# Altium schematic sheet SkyPulseUAV_MCU.SchDoc: SkyPulseUAV_MCU
size A4; Date: March 2, 2024; Author: Binhan Tian; Revision: V0.1; SheetNumber: 4; SheetTotal: 5
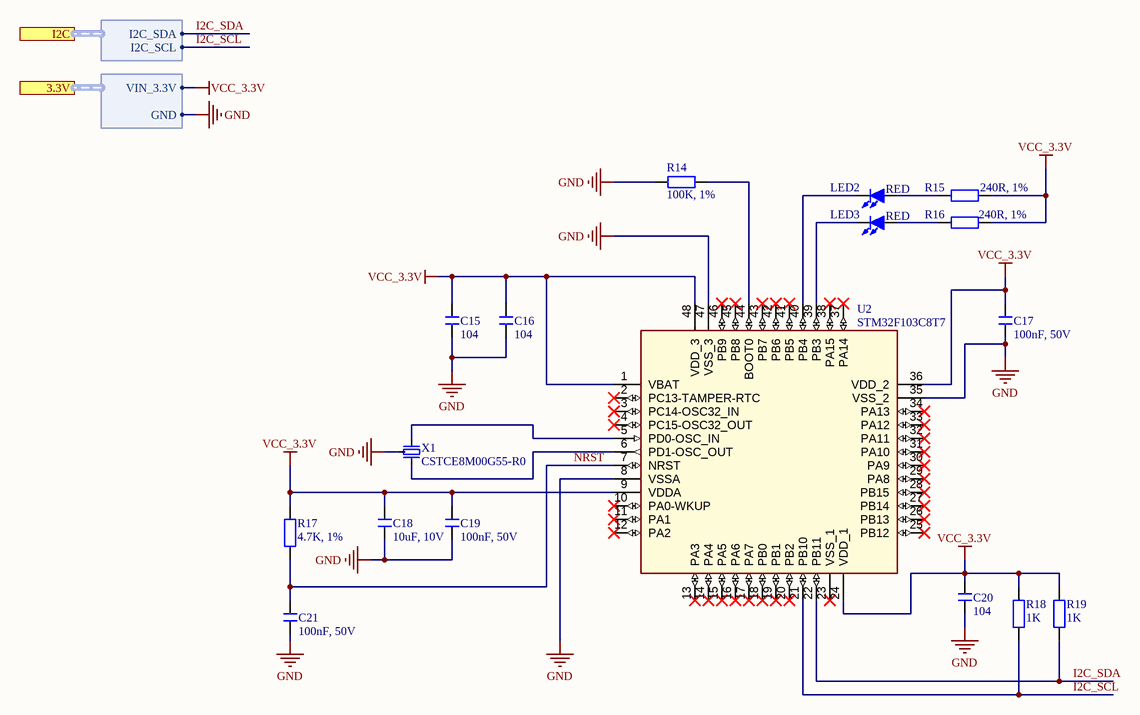
[diagram p0: SkyPulseUAV_MCU.SchDoc]

## Parts
C15  104  [C 0805_M]
C16  104  [C 0805_M]
C17  100nF, 50V  [C 0805_M]
C18  10uF, 10V  [C 0805_M]
C19  100nF, 50V  [C 0805_M]
C20  104  [C 0805_M]
C21  100nF, 50V  [C 0805_M]
LED2  RED  [LED 0805B]
LED3  RED  [LED 0805B]
R14  100K, 1%  [R 0805_M]
R15  240R, 1%  [R 0805_M]
R16  240R, 1%  [R 0805_M]
R17  4.7K, 1%  [R 0805_M]
R18  1K  [R 0805_M]
R19  1K  [R 0805_M]
U2  STM32F103C8T7  [TSQFP50P900X900X160-48L]
X1  CSTCE8M00G55-R0  [CSTCE_G]

## Ports
3.3V (harness Power), I2C (harness I2C BUS)

## Harnesses
I2C BUS: I2C_SDA, I2C_SCL
Power: VIN_3.3V, GND

## Nets
GND: C15.1 C16.1 C17.1 C18.1 C19.1 C20.2 C21.1 R14.1 U2.8(VSSA) U2.35(VSS_2) U2.47(VSS_3) X1.2(GND) ; port 3.3V.GND
VCC_3.3V: C15.2 C16.2 C17.2 C18.2 C19.2 C20.1 R15.2 R16.2 R17.2 R18.2 R19.2 U2.1(VBAT) U2.9(VDDA) U2.24(VDD_1) U2.36(VDD_2) U2.48(VDD_3) ; port 3.3V.VIN_3.3V
I2C_SCL: R18.1 U2.21(PB10) ; port I2C.I2C_SCL
I2C_SDA: R19.1 U2.22(PB11) ; port I2C.I2C_SDA
NRST: C21.2 R17.1 U2.7(NRST)
NetLED2_1: LED2.1(A) R15.1
NetLED2_2: LED2.2(K) U2.40(PB4)
NetLED3_1: LED3.1(A) R16.1
NetLED3_2: LED3.2(K) U2.39(PB3)
NetR14_2: R14.2 U2.44(BOOT0)
NetU2_5: U2.5(PD0-OSC_IN) X1.1
NetU2_6: U2.6(PD1-OSC_OUT) X1.3

Not connected (* = marked no-connect by the designer): U2 2(PC13-TAMPER-RTC)* 3(PC14-OSC32_IN)* 4(PC15-OSC32_OUT)* 10(PA0-WKUP)* 11(PA1)* 12(PA2)* 13(PA3)* 14(PA4)* 15(PA5)* 16(PA6)* 17(PA7)* 18(PB0)* 19(PB1)* 20(PB2)* 23(VSS_1)* 25(PB12)* 26(PB13)* 27(PB14)* 28(PB15)* 29(PA8)* 30(PA9)* 31(PA10)* 32(PA11)* 33(PA12)* 34(PA13)* 37(PA14)* 38(PA15)* 41(PB5)* 42(PB6)* 43(PB7)* 45(PB8)* 46(PB9)*

## Notes on the sheet
- TITLE:
- SIZE
- AUTHOR:
- REVISION:
- DATA:
- FILE NAME:
- A4
- SHEET
- OF

## Library data of the parts
C15-C21 = CAP: SMD Capacitor
LED2 LED3 = LED: SMD LED Red
R14-R19 = RES: SMD Resistor
X1 = CSTCE8M00G55-R0: Crystal Oscillator CSTCE8M00G55-R0